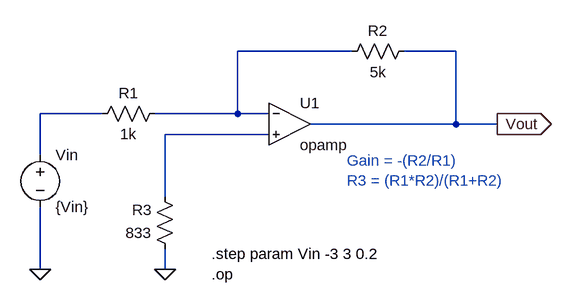
[diagram p0: schematic inverting-opamp-simple.asc]
inverting-opamp-simple.asc, the LTspice schematic file:
Version 4
SHEET 1 880 680
WIRE 464 128 288 128
WIRE 624 128 544 128
WIRE 80 224 -16 224
WIRE 288 224 288 128
WIRE 288 224 160 224
WIRE 336 224 288 224
WIRE 624 240 624 128
WIRE 624 240 400 240
WIRE 688 240 624 240
WIRE 336 256 176 256
WIRE -16 288 -16 224
WIRE 176 352 176 256
WIRE -16 464 -16 368
WIRE 176 464 176 432
FLAG 688 240 Vout
IOPIN 688 240 Out
FLAG 176 464 0
FLAG -16 464 0
SYMBOL res 176 208 R90
WINDOW 0 0 56 VBottom 2
WINDOW 3 32 56 VTop 2
SYMATTR InstName R1
SYMATTR Value 1k
SYMBOL res 560 112 R90
WINDOW 0 0 56 VBottom 2
WINDOW 3 32 56 VTop 2
SYMATTR InstName R2
SYMATTR Value 5k
SYMBOL res 192 448 R180
WINDOW 0 36 76 Left 2
WINDOW 3 36 40 Left 2
SYMATTR InstName R3
SYMATTR Value 833
SYMBOL voltage -16 272 R0
SYMATTR InstName Vin
SYMATTR Value {Vin}
SYMBOL opamp 368 176 R0
SYMATTR InstName U1
TEXT 456 296 Left 2 ;Gain = -(R2/R1)\nR3 = (R1*R2)/(R1+R2)
TEXT 248 440 Left 2 !.step param Vin -3 3 0.2\n.op

The netlist it stands for:
* inverting-opamp-simple.asc
R1 N001 N002 1k
R2 Vout N001 5k
R3 0 N003 833
Vin N002 0 {Vin}
XU1 N001 N003 Vout opamp Aol=100K GBW=10Meg  ; pins invin noninvin out
* Gain = -(R2/R1)
* R3 = (R1*R2)/(R1+R2)
.step param Vin -3 3 0.2
.op
.backanno
.end